# Altium project Dual Feeder Controller.PrjPCB (part 1 of 2)
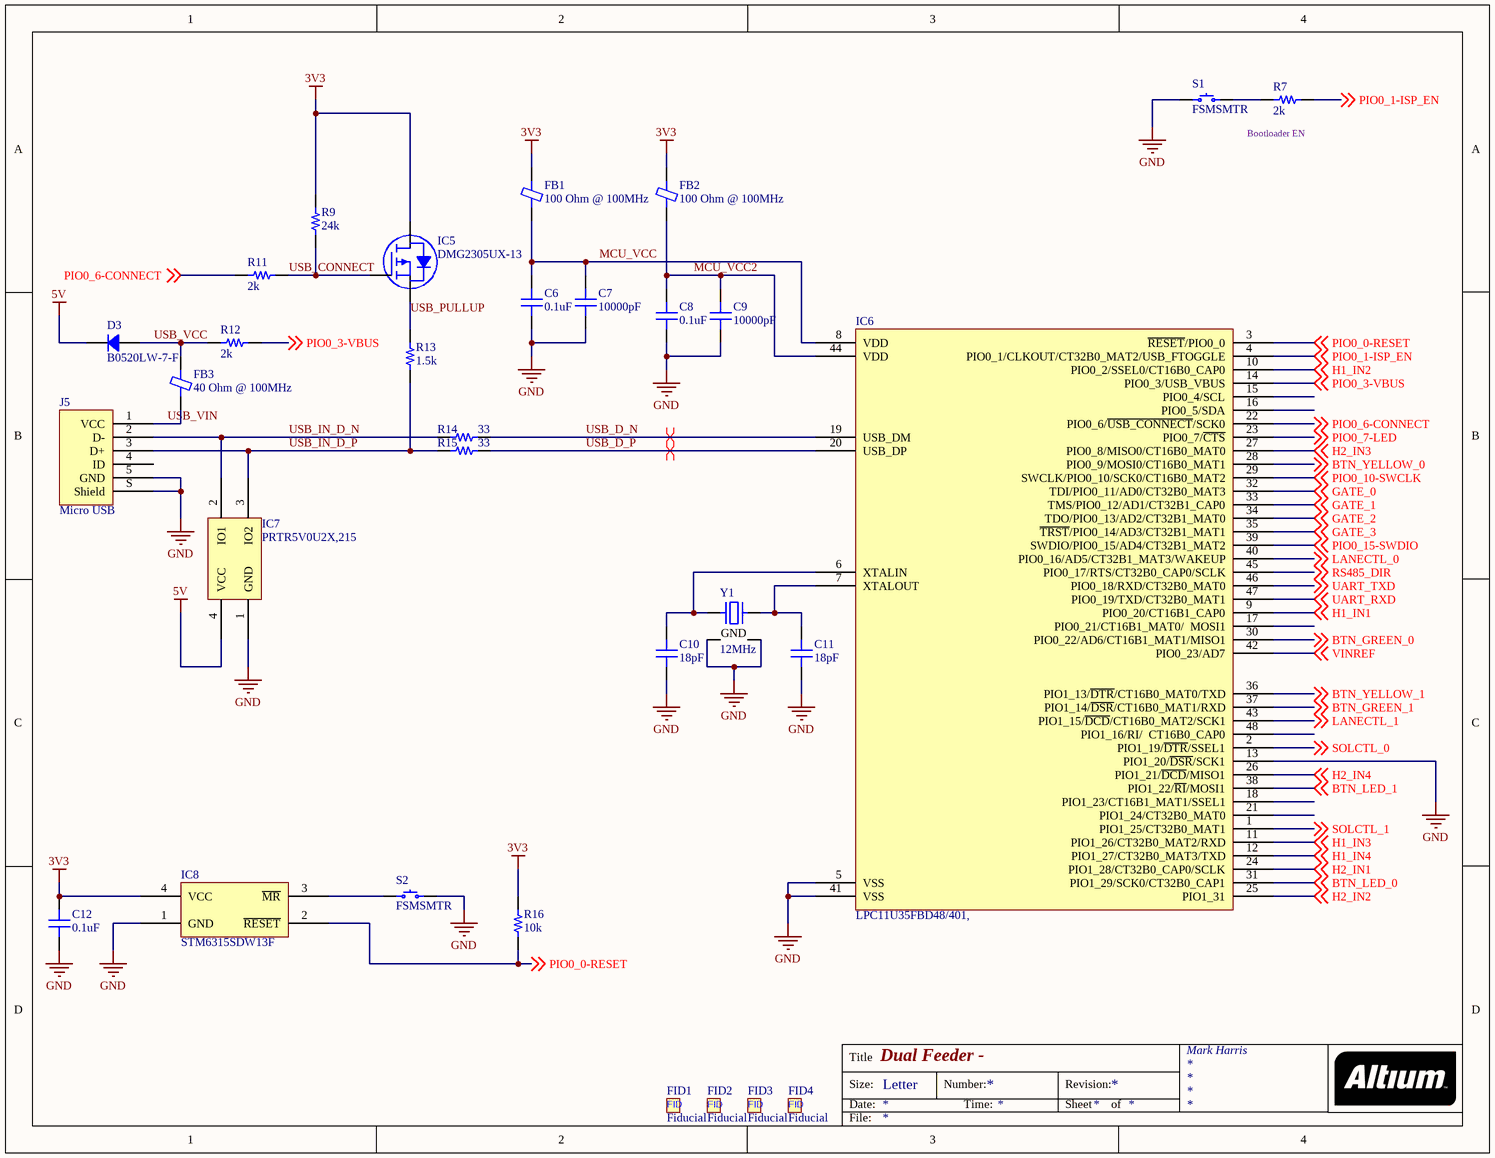
[diagram p0: Controller.SchDoc]
6 sheets, 133 parts. Net scope: global (net labels, ports and power ports of the same name join across sheets).
Board files: Feeder Board.PcbDoc, Feeder Panel.PcbDoc
Sheets:
  Controller.SchDoc
  Connectors.SchDoc
  Motor Drivers.SchDoc
  Power Supply.SchDoc
  Solenoid Drivers.SchDoc
  Light Gates.SchDoc

## Sheet Controller.SchDoc: Dual Feeder -
size Letter; DrawnBy: Mark Harris; Engineer: Mark Harris; Organization: Mark Harris; ProjectName: Dual Feeder Controller

### Parts
C6  0.1uF  [CAP 0603/1608]
C7  10000pF  [CAP 0603/1608]
C8  0.1uF  [CAP 0603/1608]
C9  10000pF  [CAP 0603/1608]
C10  18pF  [CAP 0603/1608]
C11  18pF  [CAP 0603/1608]
C12  0.1uF  [CAP 0603/1608]
D3  B0520LW-7-F  [SOD-123]
FB1  100 Ohm @ 100MHz  [FER 0603/1608]
FB2  100 Ohm @ 100MHz  [FER 0603/1608]
FB3  40 Ohm @ 100MHz  [FER 0805/2012]
FID1  Fiducial  [Fiducial]  (no BOM)
FID2  Fiducial  [Fiducial]  (no BOM)
FID3  Fiducial  [Fiducial]  (no BOM)
FID4  Fiducial  [Fiducial]  (no BOM)
IC5  DMG2305UX-13  [DIODES SOT-23-3]
IC6  LPC11U35FBD48/401,  [NXP LQFP-48 7x7mm]
IC7  PRTR5V0U2X,215  [SOT143B]
IC8  STM6315SDW13F  [ST SOT-143-4]
J5  Micro USB  [FCI USB 10118193-0001LF]
R7  2k  [RES 0603/1608]
R9  24k  [RES 0603/1608]
R11  2k  [RES 0603/1608]
R12  2k  [RES 0603/1608]
R13  1.5k  [RES 0603/1608]
R14  33  [RES 0603/1608]
R15  33  [RES 0603/1608]
R16  10k  [RES 0603/1608]
S1  FSMSMTR  [TE FSMSMTR]
S2  FSMSMTR  [TE FSMSMTR]
Y1  12MHz  [ABRACON ABM8G]

### Nets
3V3: C12.1 FB1.2 FB2.2 IC5.2(D) IC8.4(VCC) R9.2 R16.2
5V: D3.2 IC7.4(VCC)
GND: C6.2 C7.1 C8.2 C9.1 C10.1 C11.1 C12.2 IC6.5(VSS) IC6.13(PIO1_20/~{DSR}/SCK1) IC6.41(VSS) IC7.1(GND) IC8.1(GND) J5.5(GND) J5.S(Shield) S1.1 S2.2 Y1.2(GND) Y1.4(GND)
BTN_GREEN_0: IC6.30(PIO0_22/AD6/CT16B1_MAT1/MISO1) ; off-sheet BTN_GREEN_0
BTN_GREEN_1: IC6.37(PIO1_14/~{DSR}/CT16B0_MAT1/RXD) ; off-sheet BTN_GREEN_1
BTN_LED_0: IC6.31(PIO1_29/SCK0/CT32B0_CAP1) ; off-sheet BTN_LED_0
BTN_LED_1: IC6.38(PIO1_22/~{RI}/MOSI1) ; off-sheet BTN_LED_1
BTN_YELLOW_0: IC6.28(PIO0_9/MOSI0/CT16B0_MAT1) ; off-sheet BTN_YELLOW_0
BTN_YELLOW_1: IC6.36(PIO1_13/~{DTR}/CT16B0_MAT0/TXD) ; off-sheet BTN_YELLOW_1
GATE_0: IC6.32(TDI/PIO0_11/AD0/CT32B0_MAT3) ; off-sheet GATE_0
GATE_1: IC6.33(TMS/PIO0_12/AD1/CT32B1_CAP0) ; off-sheet GATE_1
GATE_2: IC6.34(TDO/PIO0_13/AD2/CT32B1_MAT0) ; off-sheet GATE_2
GATE_3: IC6.35(~{TRST}/PIO0_14/AD3/CT32B1_MAT1) ; off-sheet GATE_3
H1_IN1: IC6.9(PIO0_20/CT16B1_CAP0) ; off-sheet H1_IN1
H1_IN2: IC6.10(PIO0_2/SSEL0/CT16B0_CAP0) ; off-sheet H1_IN2
H1_IN3: IC6.11(PIO1_26/CT32B0_MAT2/RXD) ; off-sheet H1_IN3
H1_IN4: IC6.12(PIO1_27/CT32B0_MAT3/TXD) ; off-sheet H1_IN4
H2_IN1: IC6.24(PIO1_28/CT32B0_CAP0/SCLK) ; off-sheet H2_IN1
H2_IN2: IC6.25(PIO1_31) ; off-sheet H2_IN2
H2_IN3: IC6.27(PIO0_8/MISO0/CT16B0_MAT0) ; off-sheet H2_IN3
H2_IN4: IC6.26(PIO1_21/~{DCD}/MISO1) ; off-sheet H2_IN4
LANECTL_0: IC6.40(PIO0_16/AD5/CT32B1_MAT3/WAKEUP) ; off-sheet LANECTL_0
LANECTL_1: IC6.43(PIO1_15/~{DCD}/CT16B0_MAT2/SCK1) ; off-sheet LANECTL_1
MCU_VCC: C6.1 C7.2 FB1.1 IC6.8(VDD)
MCU_VCC2: C8.1 C9.2 FB2.1 IC6.44(VDD)
PIO0_0-RESET: IC6.3(~{RESET}/PIO0_0) IC8.2(~{RESET}) R16.1 ; off-sheet PIO0_0-RESET
PIO0_1-ISP_EN: IC6.4(PIO0_1/CLKOUT/CT32B0_MAT2/USB_FTOGGLE) R7.1 ; off-sheet PIO0_1-ISP_EN
PIO0_3-VBUS: IC6.14(PIO0_3/USB_VBUS) R12.1 ; off-sheet PIO0_3-VBUS
PIO0_6-CONNECT: IC6.22(PIO0_6/~{USB_CONNECT}/SCK0) R11.1 ; off-sheet PIO0_6-CONNECT
PIO0_7-LED: IC6.23(PIO0_7/~{CTS}) ; off-sheet PIO0_7-LED
PIO0_10-SWCLK: IC6.29(SWCLK/PIO0_10/SCK0/CT16B0_MAT2) ; off-sheet PIO0_10-SWCLK
PIO0_15-SWDIO: IC6.39(SWDIO/PIO0_15/AD4/CT32B1_MAT2) ; off-sheet PIO0_15-SWDIO
RS485_DIR: IC6.45(PIO0_17/RTS/CT32B0_CAP0/SCLK) ; off-sheet RS485_DIR
SOLCTL_0: IC6.2(PIO1_19/~{DTR}/SSEL1) ; off-sheet SOLCTL_0
SOLCTL_1: IC6.1(PIO1_25/CT32B0_MAT1) ; off-sheet SOLCTL_1
UART_RXD: IC6.47(PIO0_19/TXD/CT32B0_MAT1) ; off-sheet UART_RXD
UART_TXD: IC6.46(PIO0_18/RXD/CT32B0_MAT0) ; off-sheet UART_TXD
USB_CONNECT: IC5.1(G) R9.1 R11.2
USB_D_N: IC6.19(USB_DM) R14.2
USB_D_P: IC6.20(USB_DP) R15.2
USB_IN_D_N: IC7.2(IO1) J5.2(D-) R14.1
USB_IN_D_P: IC7.3(IO2) J5.3(D+) R13.1 R15.1
USB_PULLUP: IC5.3(S) R13.2
USB_VCC: D3.1 FB3.2 R12.2
USB_VIN: FB3.1 J5.1(VCC)
VINREF: IC6.42(PIO0_23/AD7) ; off-sheet VINREF
NetC10_2: C10.2 IC6.6(XTALIN) Y1.1
NetC11_2: C11.2 IC6.7(XTALOUT) Y1.3
NetIC8_3: IC8.3(~{MR}) S2.1
NetR7_2: R7.2 S1.2

Not connected (* = marked no-connect by the designer): IC6 15(PIO0_4/SCL) 16(PIO0_5/SDA) 17(PIO0_21/CT16B1_MAT0/__MOSI1) 18(PIO1_23/CT16B1_MAT1/SSEL1) 21(PIO1_24/CT32B0_MAT0) 48(PIO1_16/RI/__CT16B0_CAP0); J5 4(ID)

### Layout directives
differential pair: USB_D_N, USB_D_P

### Notes on the sheet
- Bootloader EN
- Title
- Size:
- Date:
- Letter
- Number:
- Time:
- Revision:
- Sheet
- of
- File:
- (in symbol Fiducial) FID

### Library data of the parts
C6 C8 C12 = CL10B104JB8NNNC: CAP CER 0.1UF 50V X7R 0603; Manufacturer: Samsung Electro-Mechanics America, Inc.; TemperatureRange: -55C ~ 125C; Tolerance: 5%; Value: 0.1uF; Part Number: CL10B104JB8NNNC; PartId: 5416; Supplier 1: Digi-Key; Supplier Part Number 1: 1276-1033-2-ND; ComponentLink1Description: Datasheet; ComponentLink1URL: http://www.samsungsem.com/kr/support/product-search/mlcc/CL10B104JB8NNNC.jsp; ComponentLink2Description: Digi-Key listing; ComponentLink2URL: http://digikey.com/product-detail/en/CL10B104JB8NNNC/1276-1033-2-ND/3886691; TemperatureCoefficient: X7R; Voltage: 50V; Price: 0.0132; Type: -; Device Package: 0603 (1608 Metric)
C7 C9 = CL10B103KB8NCNC: CAP CER 10000PF 50V X7R 0603; Manufacturer: Samsung Electro-Mechanics America, Inc.; TemperatureRange: -55C ~ 125C; Tolerance: 10%; Value: 10000pF; Part Number: CL10B103KB8NCNC; PartId: 13008; Supplier 1: Digi-Key; Supplier Part Number 1: 1276-1921-2-ND; ComponentLink1Description: Datasheet; ComponentLink1URL: http://www.samsungsem.com/kr/support/library/product-catalog/__icsFiles/afieldfile/2015/11/18/MLCC.pdf; ComponentLink2Description: Digi-Key Listing; ComponentLink2URL: https://www.digikey.com/product-detail/en/samsung-electro-mechanics-america-inc/CL10B103KB8NCNC/1276-1921-2-ND/3887579; TemperatureCoefficient: X7R; Voltage: 50V; Price: 0.0032; Device Package: 0603 (1608 Metric)
C10 C11 = C0603C180J5GACTU: CAP CER 18PF 50V NP0 0603; Manufacturer: Kemet; TemperatureRange: -55C ~ 125C; TemperatureCoefficient: C0G, NP0; Tolerance: 5%; Value: 18pF; Part Number: C0603C180J5GACTU; PartId: 13028; Supplier 1: Digi-Key; Supplier Part Number 1: 399-1052-2-ND; ComponentLink1Description: Datasheet; ComponentLink1URL: http://www.kemet.com/docfinder?Partnumber=C0603C180J5GACTU; ComponentLink2Description: Digi-Key Listing; ComponentLink2URL: https://www.digikey.com/product-detail/en/kemet/C0603C180J5GACTU/399-1052-2-ND/411054; Voltage: 50V; Price: 0.0064; Device Package: 0603 (1608 Metric)
D3 = B0520LW-7-F: DIODE SCHOTTKY 20V 500MA SOD123; Manufacturer: Diodes Incorporated; Current Reverse Leakage @ Vr: 250uA @ 20V; Voltage Forward (Vf): 385mV @ 500mA; Part Number: B0520LW-7-F; PartId: 14596; Supplier 1: Digi-Key; Supplier Part Number 1: B0520LW-FDITR-ND; ComponentLink1Description: Datasheet; ComponentLink1URL: http://www.diodes.com/_files/datasheets/ds30051.pdf; ComponentLink2Description: Digi-Key Listing; ComponentLink2URL: https://www.digikey.com/product-detail/en/diodes-incorporated/B0520LW-7-F/B0520LW-FDITR-ND/717687; Junction Operating Temperature: -65C ~ 125C; Price: 0.0552; Type: Schottky; Device Package: SOD-123; Voltage DC Reverse (Vr): 20V; Current Rectified: 500mA
FB1 FB2 = BKP1608HS101-T: FERRITE CHIP 100 OHM 0603; Manufacturer: Taiyo Yuden; Type: Differential Mode - Single; DC Resistance: 50 mOhm Max; Current Rating: 1.7A; Part Number: BKP1608HS101-T; PartId: 6594; Value: 100 Ohm @ 100MHz; Supplier 1: Digi-Key; Supplier Part Number 1: 587-1922-2-ND; ComponentLink1Description: Datasheet; ComponentLink1URL: http://ds.yuden.co.jp/TYCOMPAS/ut/detail.do?productNo=BKP1608HS101-T&fileName=BKP1608HS101-T_SS&mode=specSheetDownload; ComponentLink2Description: Digi-Key listing; ComponentLink2URL: http://digikey.com/product-detail/en/BKP1608HS101-T/587-1922-2-ND/957775; Price: 0.0247; Device Package: 0603 (1608 Metric)
FB3 = MMZ2012S400AT000: FERRITE CHIP 40 OHM 0805; Manufacturer: TDK Corporation; Type: Differential Mode - Single; DC Resistance: 100 mOhm Max; Current Rating: 1A; Part Number: MMZ2012S400AT000; PartId: 6800; Value: 40 Ohm @ 100MHz; Supplier 1: Digi-Key; Supplier Part Number 1: 445-2201-2-ND; ComponentLink1Description: Datasheet; ComponentLink1URL: https://product.tdk.com/info/en/catalog/datasheets/beads_commercial_signal_mmz2012_en.pdf; ComponentLink2Description: Digi-Key listing; ComponentLink2URL: http://digikey.com/product-detail/en/MMZ2012S400AT000/445-2201-2-ND/765060; Price: 0.0344; Device Package: 0805 (2012 Metric)
IC5 = DMG2305UX-13: MOSFET P-CH 20V 4.2A SOT23; Manufacturer: Diodes Incorporated; Rds On (Max) at Id, Vgs: 52 mOhm @ 4.2A, 4.5V; Vgs(th) (Max) at Id: 900mV @ 250uA; Gate Charge (Qg): 10.2nC @ 4.5V; Input Capacitance (Ciss) at Vds: 808pF @ 15V; Power - Max: 1.4W; Current Continuous Drain: 4.2A (Ta); Part Number: DMG2305UX-13; PartId: 8181; Supplier 1: Digi-Key; Supplier Part Number 1: DMG2305UX-13DITR-ND; ComponentLink1Description: Datasheet; ComponentLink1URL: http://www.diodes.com/_files/datasheets/DMG2305UX.pdf; ComponentLink2Description: Digi-Key Listing; ComponentLink2URL: http://www.digikey.com/product-detail/en/DMG2305UX-13/DMG2305UX-13DITR-ND/4251560; Price: 0.0477; Type: MOSFET P-Channel, Metal Oxide; Device Package: TO-236-3, SC-59, SOT-23-3; Drain to Source Voltage (Vdss): 20V; Features: Standard
IC6 = LPC11U35FBD48/401,: IC MCU ARM 64KB FLASH 48LQFP; Manufacturer: NXP Semiconductors; Core Processor: ARM Cortex-M0; Core Size: 32-Bit; Speed: 50MHz; Number Of IO: 40; Program Memory Size: 64KB (64K x 8); EEPROM Size: 4K x 8; Ram Size: 10K x 8; Data Converters: A/D 8x10b; Oscillator Type: Internal; Part Number: LPC11U35FBD48/401,; PartId: 9224; Supplier 1: Digi-Key; Supplier Part Number 1: 568-9584-ND; ComponentLink1Description: Datasheet; ComponentLink1URL: http://www.nxp.com/documents/data_sheet/LPC11U3X.pdf; ComponentLink2Description: Digi-Key Listing; ComponentLink2URL: https://www.digikey.com/product-detail/en/LPC11U35FBD48%2F401,/568-9584-ND/3462837; Price: 4.32; Device Package: 48-LQFP; Series: LPC11Uxx; Program Memory Type: FLASH
IC7 = PRTR5V0U2X,215: TVS DIODE 5.5VWM SOT143B; Manufacturer: NXP Semiconductors; Voltage (Breakdown): 6V; Voltage (Reverse Standoff): 5.5V (Max); Part Number: PRTR5V0U2X,215; PartId: 9755; Supplier 1: Digi-Key; Supplier Part Number 1: 568-4140-2-ND; ComponentLink1Description: Datasheet; ComponentLink1URL: http://www.nxp.com/documents/data_sheet/PRTR5V0U2X.pdf; ComponentLink2Description: Digi-Key Listing; ComponentLink2URL: http://www.digikey.com/product-detail/en/nxp-semiconductors/PRTR5V0U2X,215/568-4140-2-ND/1163690; Operating Temperature: -40C ~ 85C (TA); Price: 0.1794; Type: Steering (Rail to Rail); Device Package: TO-253-4, TO-253AA; Power - Peak Pulse: -; Current - Peak Pulse: -; Voltage (Clamping): -
IC8 = STM6315SDW13F: IC MPU RESET 2.93V 210MS SOT143-; Manufacturer: STMicroelectronics; Voltages Monitored: 1; Output: Open Drain or Open Collector; Reset: Active Low; Reset Timeout: 112 ms Minimum; PartId: 16368; Part Number: STM6315SDW13F; Supplier 1: Digi-Key; Supplier Part Number 1: 497-4975-2-ND; ComponentLink1Description: Datasheet; ComponentLink1URL: http://www.st.com/web/en/resource/technical/document/datasheet/CD00081393.pdf; ComponentLink2Description: Digi-Key Listing; ComponentLink2URL: http://www.digikey.com/product-detail/en/stmicroelectronics/STM6315SDW13F/497-4975-2-ND/1003395; Price: 0.2185; Type: Simple Reset/Power-On Reset; Device Package: TO-253-4, TO-253AA; Operating Temperature: -40C ~ 125C (TA); Voltage - Threshold: 2.93V
J5 = 10118193-0001LF: CONN USB MICRO B RECPT SMT R/A; Manufacturer: FCI; Number Of Positions: 5; Part Number: 10118193-0001LF; PartId: 7864; Supplier 1: Digi-Key; Supplier Part Number 1: 609-4616-2-ND; ComponentLink1Description: Datasheet; ComponentLink1URL: http://portal.fciconnect.com/Comergent//fci/drawing/10118193.pdf; ComponentLink2Description: Digi-Key Listing; ComponentLink2URL: http://www.digikey.ca/product-detail/en/10118193-0001LF/609-4616-2-ND/2785388; Price: 0.2823; Type: USB - micro B; Series: USB 2.0
R7 R11 R12 = ERJ-3GEYJ202V: RES SMD 2K OHM 5% 1/10W 0603; Manufacturer: Panasonic Electronic Components; TemperatureRange: -55C ~ 155C; TemperatureCoefficient: 200ppm/C; PowerRating: 0.1W, 1/10W; Value: 2k; Part Number: ERJ-3GEYJ202V; PartId: 11229; Supplier 1: Digi-Key; Supplier Part Number 1: P2.0KGTR-ND; ComponentLink1Description: Datasheet; ComponentLink1URL: http://industrial.panasonic.com/www-cgi/jvcr13pz.cgi?E+PZ+3+AOA0001+ERJ3GEYJ202V+7+WW; ComponentLink2Description: Digi-Key Listing; ComponentLink2URL: https://www.digikey.com/product-detail/en/panasonic-electronic-components/ERJ-3GEYJ202V/P2.0KGTR-ND/104349; Tolerance: 5%; Price: 0.002; Device Package: 0603 (1608 Metric)
R9 = ERJ-3GEYJ243V: RES SMD 24K OHM 5% 1/10W 0603; Manufacturer: Panasonic Electronic Components; TemperatureRange: -55C ~ 155C; TemperatureCoefficient: 200ppm/C; PowerRating: 0.1W, 1/10W; Value: 24k; Part Number: ERJ-3GEYJ243V; PartId: 11281; Supplier 1: Digi-Key; Supplier Part Number 1: P24KGTR-ND; ComponentLink1Description: Datasheet; ComponentLink1URL: http://industrial.panasonic.com/www-cgi/jvcr13pz.cgi?E+PZ+3+AOA0001+ERJ3GEYJ243V+7+WW; ComponentLink2Description: Digi-Key Listing; ComponentLink2URL: https://www.digikey.com/product-detail/en/panasonic-electronic-components/ERJ-3GEYJ243V/P24KGTR-ND/135737; Tolerance: 5%; Price: 0.002; Device Package: 0603 (1608 Metric)
R13 = ERJ-3GEYJ152V: RES SMD 1.5K OHM 5% 1/10W 0603; Manufacturer: Panasonic Electronic Components; TemperatureRange: -55C ~ 155C; TemperatureCoefficient: 200ppm/C; PowerRating: 0.1W, 1/10W; Value: 1.5k; Part Number: ERJ-3GEYJ152V; PartId: 11208; Supplier 1: Digi-Key; Supplier Part Number 1: P1.5KGTR-ND; ComponentLink1Description: Datasheet; ComponentLink1URL: http://industrial.panasonic.com/www-cgi/jvcr13pz.cgi?E+PZ+3+AOA0001+ERJ3GEYJ152V+7+WW; ComponentLink2Description: Digi-Key Listing; ComponentLink2URL: https://www.digikey.com/product-detail/en/panasonic-electronic-components/ERJ-3GEYJ152V/P1.5KGTR-ND/104381; Tolerance: 5%; Price: 0.002; Device Package: 0603 (1608 Metric)
R14 R15 = ERJ-3EKF33R0V: RES SMD 33 OHM 1% 1/10W 0603; Manufacturer: Panasonic Electronic Components; TemperatureRange: -55C ~ 155C; TemperatureCoefficient: 100ppm/C; PowerRating: 0.1W, 1/10W; Value: 33; Part Number: ERJ-3EKF33R0V; PartId: 901; Supplier 1: Digi-Key; Supplier Part Number 1: P33.0HTR-ND; ComponentLink1Description: Datasheet; ComponentLink1URL: http://industrial.panasonic.com/www-cgi/jvcr13pz.cgi?E+PZ+3+AOA0002+ERJ3EKF33R0V+7+WW; ComponentLink2Description: Digi-Key listing; ComponentLink2URL: http://digikey.com/product-detail/en/ERJ-3EKF33R0V/P33.0HTR-ND/1746383; Tolerance: 1%; Price: 0.0038; Type: Thick Film; Device Package: 0603 (1608 Metric)
R16 = ERJ-3GEYJ103V: RES SMD 10K OHM 5% 1/10W 0603; Manufacturer: Panasonic Electronic Components; TemperatureRange: -55C ~ 155C; TemperatureCoefficient: 200ppm/C; PowerRating: 0.1W, 1/10W; Value: 10k; Part Number: ERJ-3GEYJ103V; PartId: 11175; Supplier 1: Digi-Key; Supplier Part Number 1: P10KGTR-ND; ComponentLink1Description: Datasheet; ComponentLink1URL: http://industrial.panasonic.com/www-cgi/jvcr13pz.cgi?E+PZ+3+AOA0001+ERJ3GEYJ103V+7+WW; ComponentLink2Description: Digi-Key Listing; ComponentLink2URL: https://www.digikey.com/product-detail/en/panasonic-electronic-components/ERJ-3GEYJ103V/P10KGTR-ND/135662; Tolerance: 5%; Price: 0.002; Device Package: 0603 (1608 Metric)
S1 S2 = FSMSMTR: SWITCH TACTILE SPST-NO 0.05A 24V; Manufacturer: TE Connectivity Alcoswitch Switches; Switch Function: Off-Mom; Contact Rating @ Voltage: 0.05A @ 24VDC; Actuator Type: Standard; Actuator Orientation: Top Actuated; Illumination: Non-Illuminated; Operating Force: 180gf; Switch Travel: 0.25mm; Mechanical Life: 20,000 Cycles; Part Number: FSMSMTR; PartId: 8251; Supplier 1: Digi-Key; Supplier Part Number 1: 450-1758-2-ND; ComponentLink1Description: Datasheet; ComponentLink1URL: http://www.te.com/commerce/DocumentDelivery/DDEController?Action=srchrtrv&DocNm=1437566-3&DocType=Customer+Drawing&DocLang=English; ComponentLink2Description: Digi-Key Listing; ComponentLink2URL: http://www.digikey.com/product-detail/en/FSMSMTR/450-1758-2-ND/529671; Price: 0.175; Circuit: SPST-NO; Illumination Voltage: -; Illumination Type, Colour: -; Operating Temperature: -35C ~ 85C
Y1 = ABM8G-12.000MHZ-4Y-T3: CRYSTAL 12.0000MHZ 10PF SMD; Manufacturer: Abracon LLC; Frequency Stability: 30ppm; ESR: 120 Ohm; Operating Mode: Fundamental; Part Number: ABM8G-12.000MHZ-4Y-T3; PartId: 8771; Supplier 1: Digi-Key; Supplier Part Number 1: 535-10901-2-ND; ComponentLink1Description: Datasheet; ComponentLink1URL: http://www.abracon.com/Resonators/ABM8G.pdf; ComponentLink2Description: Digi-Key Listing; ComponentLink2URL: https://www.digikey.com/product-detail/en/ABM8G-12.000MHZ-4Y-T3/535-10901-2-ND/2623783; Price: 0.24; Type: MHz Crystal; Device Package: 4-SMD, No Lead (DFN, LCC); Series: ABM8G; Frequency: 12MHz; Frequency Tolerance: 30ppm; Load Capacitance: 10pF

## Sheet Connectors.SchDoc: Dual Feeder -
size Letter; DrawnBy: Mark Harris; Engineer: Mark Harris; Organization: Mark Harris; ProjectName: Dual Feeder Controller
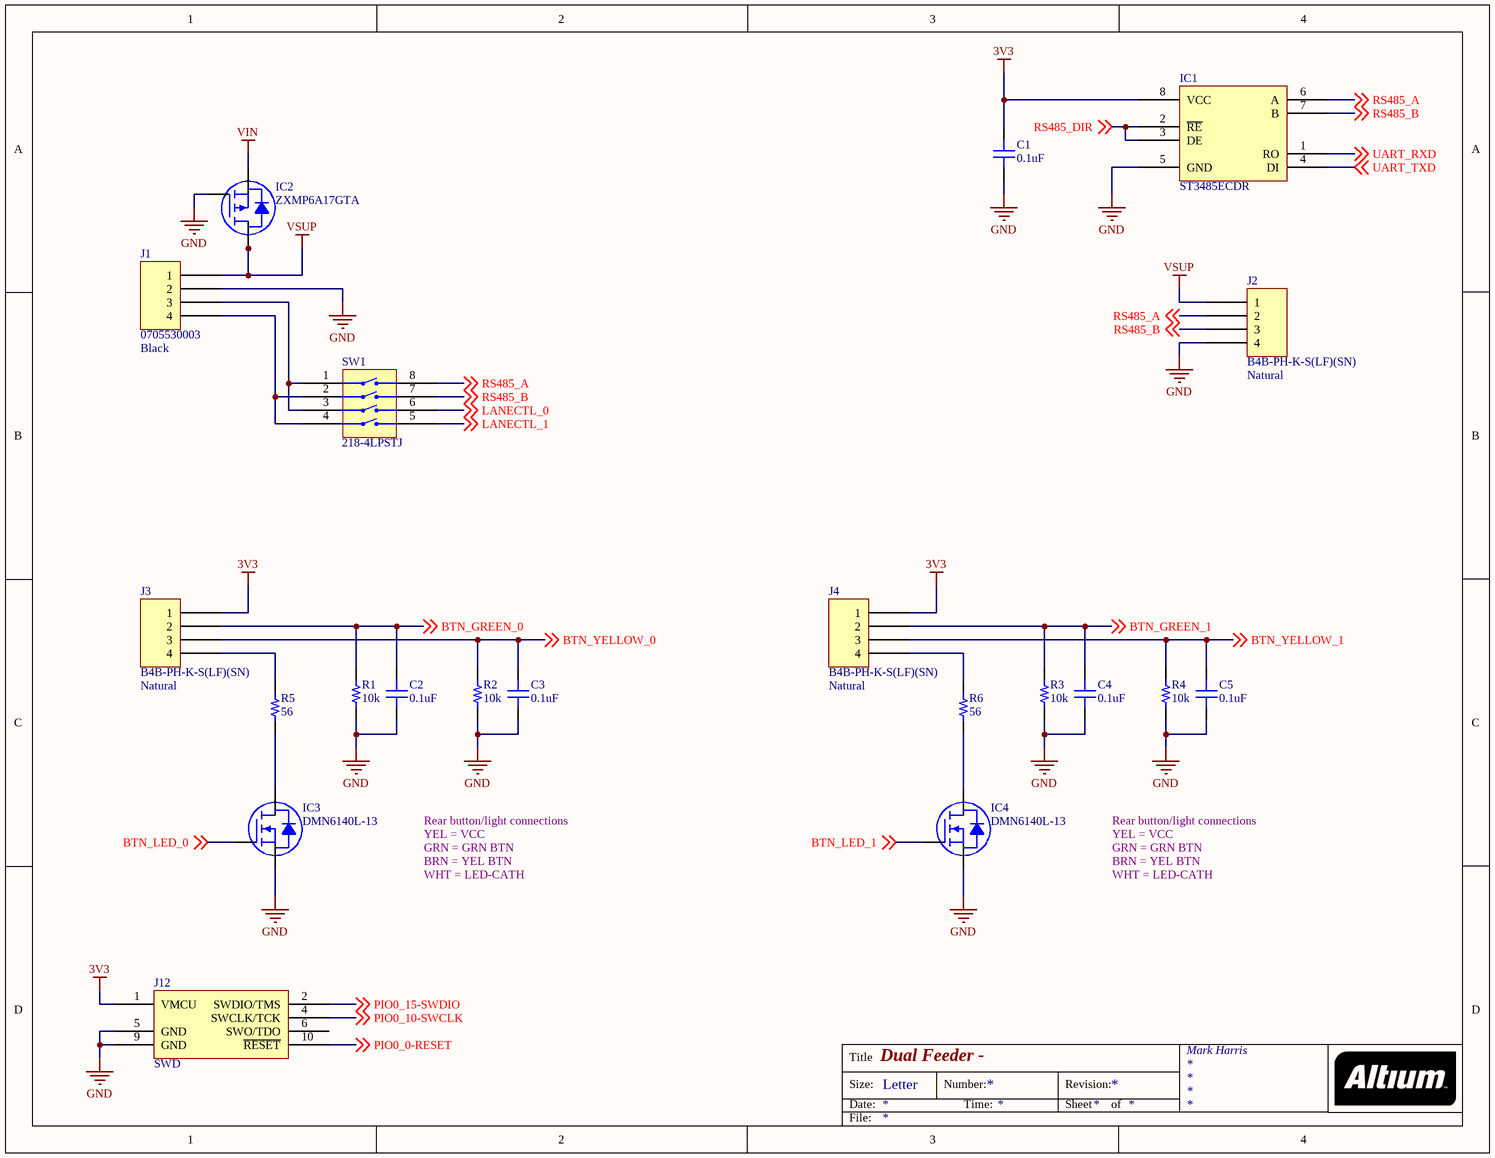
[diagram p1: Connectors.SchDoc]

### Parts
C1  0.1uF  [CAP 0603/1608]
C2  0.1uF  [CAP 0603/1608]
C3  0.1uF  [CAP 0603/1608]
C4  0.1uF  [CAP 0603/1608]
C5  0.1uF  [CAP 0603/1608]
IC1  ST3485ECDR  [ST SOIC-8N]
IC2  ZXMP6A17GTA  [DIODES SOT-223]
IC3  DMN6140L-13  [DIODES SOT-23-3]
IC4  DMN6140L-13  [DIODES SOT-23-3]
J1  0705530003  Colour: Black  [MOLEX SDA-70553-4PIN]
J2  B4B-PH-K-S(LF)(SN)  Colour: Natural  [JST B4B-PH-K]
J3  B4B-PH-K-S(LF)(SN)  Colour: Natural  [JST B4B-PH-K]
J4  B4B-PH-K-S(LF)(SN)  Colour: Natural  [JST B4B-PH-K]
J12  SWD  [10 Pin SWD]  (no BOM)
R1  10k  [RES 0603/1608]
R2  10k  [RES 0603/1608]
R3  10k  [RES 0603/1608]
R4  10k  [RES 0603/1608]
R5  56  [RES 0603/1608]
R6  56  [RES 0603/1608]
SW1  218-4LPSTJ  [CTS 218-4LPJ]

### Nets
3V3: C1.1 IC1.8(VCC) J3.1 J4.1 J12.1(VMCU)
GND: C1.2 C2.2 C3.2 C4.2 C5.2 IC1.5(GND) IC2.1(G) IC3.3(S) IC4.3(S) J1.2 J2.4 J12.5(GND) J12.9(GND) R1.1 R2.1 R3.1 R4.1
VIN: IC2.3(S)
VSUP: IC2.2(D) IC2.4(D) J1.1 J2.1
BTN_GREEN_0: C2.1 J3.2 R1.2 ; off-sheet BTN_GREEN_0
BTN_GREEN_1: C4.1 J4.2 R3.2 ; off-sheet BTN_GREEN_1
BTN_LED_0: IC3.1(G) ; off-sheet BTN_LED_0
BTN_LED_1: IC4.1(G) ; off-sheet BTN_LED_1
BTN_YELLOW_0: C3.1 J3.3 R2.2 ; off-sheet BTN_YELLOW_0
BTN_YELLOW_1: C5.1 J4.3 R4.2 ; off-sheet BTN_YELLOW_1
LANECTL_0: SW1.6 ; off-sheet LANECTL_0
LANECTL_1: SW1.5 ; off-sheet LANECTL_1
PIO0_0-RESET: J12.10(~{RESET}) ; off-sheet PIO0_0-RESET
PIO0_10-SWCLK: J12.4(SWCLK/TCK) ; off-sheet PIO0_10-SWCLK
PIO0_15-SWDIO: J12.2(SWDIO/TMS) ; off-sheet PIO0_15-SWDIO
RS485_A: IC1.6(A) J2.2 SW1.8 ; off-sheet RS485_A
RS485_B: IC1.7(B) J2.3 SW1.7 ; off-sheet RS485_B
RS485_DIR: IC1.2(~{RE}) IC1.3(DE) ; off-sheet RS485_DIR
UART_RXD: IC1.1(RO) ; off-sheet UART_RXD
UART_TXD: IC1.4(DI) ; off-sheet UART_TXD
NetIC3_2: IC3.2(D) R5.1
NetIC4_2: IC4.2(D) R6.1
NetJ1_3: J1.3 SW1.1(GND) SW1.3(GND)
NetJ1_4: J1.4 SW1.2(GND) SW1.4(GND)
NetJ3_4: J3.4 R5.2
NetJ4_4: J4.4 R6.2

Not connected (* = marked no-connect by the designer): J12 6(SWO/TDO)

### Notes on the sheet
- Rear button/light connections
- YEL = VCC
- GRN = GRN BTN
- BRN = YEL BTN
- WHT = LED-CATH
- Title
- Size:
- Date:
- Letter
- Number:
- Time:
- Revision:
- Sheet
- of
- File:

### Library data of the parts
C1-C5 = CL10B104JB8NNNC: as C6 on sheet Controller; Value: 0.1uF; Part Number: CL10B104JB8NNNC; PartId: 5416; Supplier 1: Digi-Key; Supplier Part Number 1: 1276-1033-2-ND; ComponentLink1Description: Datasheet; ComponentLink1URL: http://www.samsungsem.com/kr/support/product-search/mlcc/CL10B104JB8NNNC.jsp; ComponentLink2Description: Digi-Key listing; ComponentLink2URL: http://digikey.com/product-detail/en/CL10B104JB8NNNC/1276-1033-2-ND/3886691; TemperatureCoefficient: X7R; Voltage: 50V; Price: 0.0132; Type: -; Device Package: 0603 (1608 Metric)
IC1 = ST3485ECDR: IC TXRX RS422/485 15MBPS 8SO; Manufacturer: STMicroelectronics; Protocol: RS422, RS485; Number of Drivers/Receivers: 1/1; Duplex: Half; Receiver Hysteresis: 70mV; Voltage - Supply: 3 V ~ 3.6 V; Part Number: ST3485ECDR; PartId: 16405; Supplier 1: Digi-Key; Supplier Part Number 1: 497-6540-2-ND; ComponentLink1Description: Datasheet; ComponentLink1URL: http://www.st.com/content/ccc/resource/technical/document/datasheet/be/f4/e5/fd/b0/df/40/72/CD00003137.pdf/files/CD00003137.pdf/jcr:content/translations/en.CD00003137.pdf; ComponentLink2Description: Digi-Key Listing; ComponentLink2URL: https://www.digikey.com/product-detail/en/stmicroelectronics/ST3485ECDR/497-6540-2-ND/1039255; Price: 0.6076; Type: Transceiver; Device Package: 8-SOIC (0.154", 3.90mm Width); Operating Temperature: 0C ~ 70C; Data Rate: 15Mbps
IC2 = ZXMP6A17GTA: MOSFET P-CH 60V 3A SOT223; Manufacturer: Diodes Incorporated; Rds On (Max) at Id, Vgs: 125 mOhm @ 2.2A, 10V; Vgs(th) (Max) at Id: 1V @ 250uA; Gate Charge (Qg): 17.7nC @ 10V; Input Capacitance (Ciss) at Vds: 637pF @ 30V; Power - Max: 2W; Current Continuous Drain: 3A (Ta); Part Number: ZXMP6A17GTA; PartId: 8208; Supplier 1: Digi-Key; Supplier Part Number 1: ZXMP6A17GTR-ND; ComponentLink1Description: Datasheet; ComponentLink1URL: http://www.diodes.com/_files/datasheets/ZXMP6A17G.pdf; ComponentLink2Description: Digi-Key Listing; ComponentLink2URL: http://www.digikey.com/product-detail/en/ZXMP6A17GTA/ZXMP6A17GTR-ND/560634; Price: 0.304; Type: MOSFET P-Channel, Metal Oxide; Device Package: TO-261-4, TO-261AA; Drain to Source Voltage (Vdss): 60V; Features: Standard
IC3 IC4 = DMN6140L-13: MOSFET N-CH 60V 1.6A SOT23; Manufacturer: Diodes Incorporated; Rds On (Max) at Id, Vgs: 140 mOhm @ 1.8A, 10V; Vgs(th) (Max) at Id: 20V; Gate Charge (Qg): 8.6nC @ 10V; Input Capacitance (Ciss) at Vds: 315pF @ 40V; Current Continuous Drain: 1.6A (Ta); Part Number: DMN6140L-13; PartId: 29565; Supplier 1: Digi-Key; Supplier Part Number 1: DMN6140L-13DICT-ND; ComponentLink1Description: Datasheet; ComponentLink1URL: http://diodes.com/_files/datasheets/DMN6140L.pdf; ComponentLink2Description: Digi-Key Listing; ComponentLink2URL: https://www.digikey.com/product-detail/en/diodes-incorporated/DMN6140L-13/DMN6140L-13DICT-ND/5218250; Price: 0.51; Type: N-Channel; Device Package: TO-236-3, SC-59, SOT-23-3; Drain to Source Voltage (Vdss): 60V
J1 = 0705530003: CONN HEADER 4POS .100 R/A GOLD; Manufacturer: Molex, LLC; Pitch: 0.100" (2.54mm); Number Of Positions: 4; Part Number: 0705530003; PartId: 7806; Supplier 1: Digi-Key; Supplier Part Number 1: WM4902-ND; ComponentLink1Description: Datasheet; ComponentLink1URL: http://www.molex.com/pdm_docs/sd/705530002_sd.pdf; ComponentLink2Description: Digi-Key Listing; ComponentLink2URL: http://www.digikey.ca/product-detail/en/0705530003/WM4902-ND/114959; Price: 1.58; Type: Through Hole, Right Angle; Contact Finish: Gold; Fastening Type: Latch Holder; Number Of Rows: 1; Series: 70553
J2-J4 = B4B-PH-K-S(LF)(SN): CONN HEADER PH TOP 4POS 2MM; Manufacturer: JST Sales America Inc.; Pitch: 0.079" (2.00mm); Number Of Positions: 4; Part Number: B4B-PH-K-S(LF)(SN); PartId: 29449; Supplier 1: Digi-Key; Supplier Part Number 1: 455-1706-ND; ComponentLink1Description: Datasheet; ComponentLink1URL: http://www.jst-mfg.com/product/pdf/eng/ePH.pdf; ComponentLink2Description: Digi-Key Listing; ComponentLink2URL: http://www.digikey.com/product-detail/en/jst-sales-america-inc/B4B-PH-K-S(LF)(SN)/455-1706-ND/926613; Price: 0.24; Type: Header, Shrouded; Contact Finish: Tin; Fastening Type: Detent Lock; Number Of Rows: 1; Series: PH
R1-R4 = ERJ-3GEYJ103V: as R16 on sheet Controller; Value: 10k; Part Number: ERJ-3GEYJ103V; PartId: 11175; Supplier 1: Digi-Key; Supplier Part Number 1: P10KGTR-ND; ComponentLink1Description: Datasheet; ComponentLink1URL: http://industrial.panasonic.com/www-cgi/jvcr13pz.cgi?E+PZ+3+AOA0001+ERJ3GEYJ103V+7+WW; ComponentLink2Description: Digi-Key Listing; ComponentLink2URL: https://www.digikey.com/product-detail/en/panasonic-electronic-components/ERJ-3GEYJ103V/P10KGTR-ND/135662; Tolerance: 5%; Price: 0.002; Device Package: 0603 (1608 Metric)
R5 R6 = ERJ-3GEYJ560V: RES SMD 56 OHM 5% 1/10W 0603; Manufacturer: Panasonic Electronic Components; TemperatureRange: -55C ~ 155C; TemperatureCoefficient: 200ppm/C; PowerRating: 0.1W, 1/10W; Value: 56; Part Number: ERJ-3GEYJ560V; PartId: 11243; Supplier 1: Digi-Key; Supplier Part Number 1: P56GTR-ND; ComponentLink1Description: Datasheet; ComponentLink1URL: http://industrial.panasonic.com/www-cgi/jvcr13pz.cgi?E+PZ+3+AOA0001+ERJ3GEYJ560V+7+WW; ComponentLink2Description: Digi-Key Listing; ComponentLink2URL: https://www.digikey.com/product-detail/en/panasonic-electronic-components/ERJ-3GEYJ560V/P56GTR-ND/135638; Tolerance: 5%; Price: 0.002; Device Package: 0603 (1608 Metric)
SW1 = 218-4LPSTJ: SWITCH SLIDE DIP 4POS SPST 25MA 24V; Manufacturer: CTS Electrocomponents; Number Of Positions: 4; Voltage: 24VDC; Actuator Type: Slide (Standard); Actuator Level: Flush, Recessed; Electrical Life: 1,000 Cycles; Part Number: 218-4LPSTJ; PartId: 21129; Supplier 1: Digi-Key; Supplier Part Number 1: CT3109-ND; ComponentLink1Description: Datasheet; ComponentLink1URL: http://www.ctscorp.com/wp-content/uploads/2015/11/218.pdf; ComponentLink2Description: Digi-Key Listing; ComponentLink2URL: http://www.digikey.com/product-detail/en/cts-electrocomponents/218-4LPSTJ/CT3109-ND/5223842; Price: 1.3; TYPE: DIP Switches; Part Status: Active; Series: 218; Circuit: SPST; Current Rating: 25mA; Contact Finish: Gold; Height Above Board: 0.106" (2.70mm); Termination Style: J Lead; Body Material: -; Mechanical Life: -; Operating Temperature: -55C ~ 85C

## Sheet Motor Drivers.SchDoc: Dual Feeder - Motor Drivers
size Letter; DrawnBy: Mark Harris; Engineer: Mark Harris; Organization: Mark Harris; ProjectName: Dual Feeder Controller
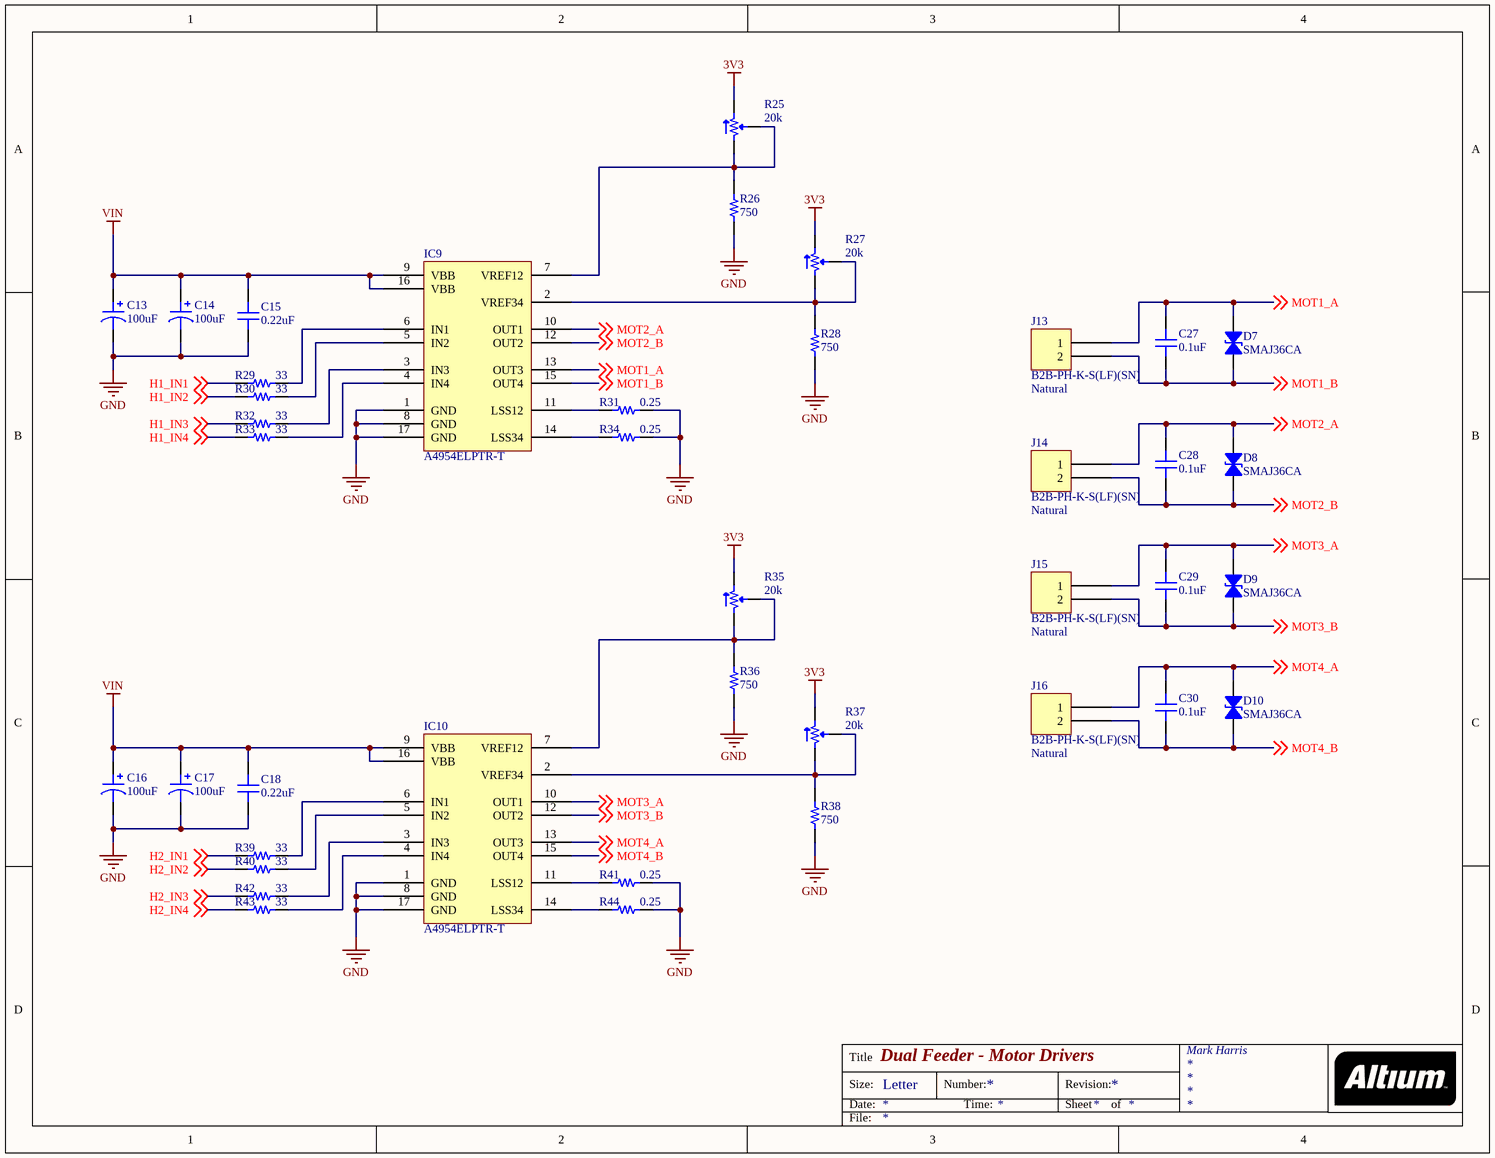
[diagram p2: Motor Drivers.SchDoc]

### Parts
C13  100uF  [CAP ALUM 8.3MM]
C14  100uF  [CAP ALUM 8.3MM]
C15  0.22uF  [CAP 0805/2012]
C16  100uF  [CAP ALUM 8.3MM]
C17  100uF  [CAP ALUM 8.3MM]
C18  0.22uF  [CAP 0805/2012]
C27  0.1uF  [CAP 0603/1608]
C28  0.1uF  [CAP 0603/1608]
C29  0.1uF  [CAP 0603/1608]
C30  0.1uF  [CAP 0603/1608]
D7  SMAJ36CA  [Bourns DO214AC SMA]
D8  SMAJ36CA  [Bourns DO214AC SMA]
D9  SMAJ36CA  [Bourns DO214AC SMA]
D10  SMAJ36CA  [Bourns DO214AC SMA]
IC9  A4954ELPTR-T  [ALLEGRO TSSOP-16EP LP]
IC10  A4954ELPTR-T  [ALLEGRO TSSOP-16EP LP]
J13  B2B-PH-K-S(LF)(SN)  Colour: Natural  [JST B2B-PH-K]
J14  B2B-PH-K-S(LF)(SN)  Colour: Natural  [JST B2B-PH-K]
J15  B2B-PH-K-S(LF)(SN)  Colour: Natural  [JST B2B-PH-K]
J16  B2B-PH-K-S(LF)(SN)  Colour: Natural  [JST B2B-PH-K]
R25  20k  [POT BOURNS TRIMPOT 3302]
R26  750  [RES 0603/1608]
R27  20k  [POT BOURNS TRIMPOT 3302]
R28  750  [RES 0603/1608]
R29  33  [RES 0603/1608]
R30  33  [RES 0603/1608]
R31  0.25  [STACKPOLE CSR1206]
R32  33  [RES 0603/1608]
R33  33  [RES 0603/1608]
R34  0.25  [STACKPOLE CSR1206]
R35  20k  [POT BOURNS TRIMPOT 3302]
R36  750  [RES 0603/1608]
R37  20k  [POT BOURNS TRIMPOT 3302]
R38  750  [RES 0603/1608]
R39  33  [RES 0603/1608]
R40  33  [RES 0603/1608]
R41  0.25  [STACKPOLE CSR1206]
R42  33  [RES 0603/1608]
R43  33  [RES 0603/1608]
R44  0.25  [STACKPOLE CSR1206]

### Nets
3V3: R25.3 R27.3 R35.3 R37.3
GND: C13.2 C14.2 C15.1 C16.2 C17.2 C18.1 IC9.1(GND) IC9.8(GND) IC9.17(GND) IC10.1(GND) IC10.8(GND) IC10.17(GND) R26.1 R28.1 R31.2 R34.2 R36.1 R38.1 R41.2 R44.2
VIN: C13.1 C14.1 C15.2 C16.1 C17.1 C18.2 IC9.9(VBB) IC9.16(VBB) IC10.9(VBB) IC10.16(VBB)
H1_IN1: R29.1 ; off-sheet H1_IN1
H1_IN2: R30.1 ; off-sheet H1_IN2
H1_IN3: R32.1 ; off-sheet H1_IN3
H1_IN4: R33.1 ; off-sheet H1_IN4
H2_IN1: R39.1 ; off-sheet H2_IN1
H2_IN2: R40.1 ; off-sheet H2_IN2
H2_IN3: R42.1 ; off-sheet H2_IN3
H2_IN4: R43.1 ; off-sheet H2_IN4
MOT1_A: C27.1 D7.2 IC9.13(OUT3) J13.1 ; off-sheet MOT1_A
MOT1_B: C27.2 D7.1 IC9.15(OUT4) J13.2 ; off-sheet MOT1_B
MOT2_A: C28.1 D8.2 IC9.10(OUT1) J14.1 ; off-sheet MOT2_A
MOT2_B: C28.2 D8.1 IC9.12(OUT2) J14.2 ; off-sheet MOT2_B
MOT3_A: C29.1 D9.2 IC10.10(OUT1) J15.1 ; off-sheet MOT3_A
MOT3_B: C29.2 D9.1 IC10.12(OUT2) J15.2 ; off-sheet MOT3_B
MOT4_A: C30.1 D10.2 IC10.13(OUT3) J16.1 ; off-sheet MOT4_A
MOT4_B: C30.2 D10.1 IC10.15(OUT4) J16.2 ; off-sheet MOT4_B
NetIC9_2: IC9.2(VREF34) R27.1 R27.2 R28.2
NetIC9_3: IC9.3(IN3) R32.2
NetIC9_4: IC9.4(IN4) R33.2
NetIC9_5: IC9.5(IN2) R30.2
NetIC9_6: IC9.6(IN1) R29.2
NetIC9_7: IC9.7(VREF12) R25.1 R25.2 R26.2
NetIC9_11: IC9.11(LSS12) R31.1
NetIC9_14: IC9.14(LSS34) R34.1
NetIC10_2: IC10.2(VREF34) R37.1 R37.2 R38.2
NetIC10_3: IC10.3(IN3) R42.2
NetIC10_4: IC10.4(IN4) R43.2
NetIC10_5: IC10.5(IN2) R40.2
NetIC10_6: IC10.6(IN1) R39.2
NetIC10_7: IC10.7(VREF12) R35.1 R35.2 R36.2
NetIC10_11: IC10.11(LSS12) R41.1
NetIC10_14: IC10.14(LSS34) R44.1

### Notes on the sheet
- Title
- Size:
- Date:
- Letter
- Number:
- Time:
- Revision:
- Sheet
- of
- File:

### Library data of the parts
C13 C14 C16 C17 = UWT1H101MNL1GS: CAP ALUM 100UF 20% 50V SMD; Manufacturer: Nichicon; TemperatureRange: -55C ~ 105C; Type: General Purpose; Ripple Current: 140mA; Lifetime @ Temp: 1000 Hrs @ 105C; Value: 100uF; Part Number: UWT1H101MNL1GS; PartId: 7285; Supplier 1: Digi-Key; Supplier Part Number 1: 493-2226-2-ND; ComponentLink1Description: Datasheet; ComponentLink1URL: http://nichicon-us.com/english/products/pdfs/e-wt.pdf; ComponentLink2Description: Digi-Key listing; ComponentLink2URL: http://digikey.com/product-detail/en/UWT1H101MNL1GS/493-2226-2-ND/589967; Tolerance: 20%; Voltage: 50V; Price: 0.2178; Device Package: Radial, Can - SMD; Impedance: -
C15 C18 = CL21B224KBFSFNE: CAP CER 0.22UF 50V X7R 0805; Manufacturer: Samsung Electro-Mechanics America, Inc.; TemperatureRange: -55C ~ 125C; Tolerance: 10%; Value: 0.22uF; Part Number: CL21B224KBFSFNE; PartId: 13765; Supplier 1: Digi-Key; Supplier Part Number 1: 1276-2948-2-ND; ComponentLink1Description: Datasheet; ComponentLink1URL: //media.digikey.com/pdf/Data%20Sheets/Samsung%20PDFs/CL21B224KBFSFNE_Spec.pdf; ComponentLink2Description: Digi-Key Listing; ComponentLink2URL: https://www.digikey.com/product-detail/en/samsung-electro-mechanics-america-inc/CL21B224KBFSFNE/1276-2948-2-ND/3888606; TemperatureCoefficient: X7R; Voltage: 50V; Price: 0.0195; Device Package: 0805 (2012 Metric)
C27-C30 = CL10B104JB8NNNC: as C6 on sheet Controller; Value: 0.1uF; Part Number: CL10B104JB8NNNC; PartId: 5416; Supplier 1: Digi-Key; Supplier Part Number 1: 1276-1033-2-ND; ComponentLink1Description: Datasheet; ComponentLink1URL: http://www.samsungsem.com/kr/support/product-search/mlcc/CL10B104JB8NNNC.jsp; ComponentLink2Description: Digi-Key listing; ComponentLink2URL: http://digikey.com/product-detail/en/CL10B104JB8NNNC/1276-1033-2-ND/3886691; TemperatureCoefficient: X7R; Voltage: 50V; Price: 0.0132; Type: -; Device Package: 0603 (1608 Metric)
D7-D10 = SMAJ36CA: TVS DIODE 36VWM 58.1VC DO214AC; Manufacturer: Bourns Inc.; Type: Zener; Bidirectional Channels: 1; Power - Peak Pulse: 400W; Current - Peak Pulse: 6.9A; Voltage (Clamping): 58.1V; Voltage (Breakdown): 40V; Voltage (Reverse Standoff): 36V; Part Number: SMAJ36CA; PartId: 14838; Supplier 1: Digi-Key; Supplier Part Number 1: SMAJ36CABTR-ND; ComponentLink1Description: Datasheet; ComponentLink1URL: http://www.bourns.com/docs/Product-Datasheets/SMAJ.pdf; ComponentLink2Description: Digi-Key Listing; ComponentLink2URL: https://www.digikey.com/product-detail/en/bourns-inc/SMAJ36CA/SMAJ36CABTR-ND/2254607; Operating Temperature: -55C ~ 150C (TJ); Price: 0.0992; Device Package: DO-214AC, SMA
IC9 IC10 = A4954ELPTR-T: IC MOTOR DRIVER PAR 16TSSOP; Manufacturer: Allegro MicroSystems, LLC; Motor Type - AC, DC: Brushed DC; Function: Driver - Fully Integrated, Control and Power Stage; Output Configuration: Half Bridge (4); Interface: Parallel; Current - Output: 2A; Voltage - Supply: 8 V ~ 40 V; Part Number: A4954ELPTR-T; PartId: 27911; Supplier 1: Digi-Key; Supplier Part Number 1: 620-1384-1-ND; ComponentLink1Description: Datasheet; ComponentLink1URL: http://www.allegromicro.com/~/media/Files/Datasheets/A4954-Datasheet.ashx; ComponentLink2Description: Digi-Key Listing; ComponentLink2URL: http://www.digikey.com/product-detail/en/allegro-microsystems-llc/A4954ELPTR-T/620-1384-1-ND/2509924; Price: 2.84; Device Package: 16-TSSOP (0.173", 4.40mm Width) Exposed Pad; Motor Type - Stepper: -; Technology: DMOS; Step Resolution: -; Voltage - Load: 8 V ~ 40 V
J13-J16 = B2B-PH-K-S(LF)(SN): CONN HEADER PH TOP 2POS 2MM; Manufacturer: JST Sales America Inc.; Pitch: 0.079" (2.00mm); Number Of Positions: 2; Part Number: B2B-PH-K-S(LF)(SN); PartId: 29447; Supplier 1: Digi-Key; Supplier Part Number 1: 455-1704-ND; ComponentLink1Description: Datasheet; ComponentLink1URL: http://www.jst-mfg.com/product/pdf/eng/ePH.pdf; ComponentLink2Description: Digi-Key Listing; ComponentLink2URL: http://www.digikey.com/product-detail/en/jst-sales-america-inc/B2B-PH-K-S(LF)(SN)/455-1704-ND/926611; Price: 0.17; Type: Header, Shrouded; Contact Finish: Tin; Fastening Type: Detent Lock; Number Of Rows: 1; Series: PH
R25 R27 R35 R37 = 3302W-3-203E: TRIMMER 20K OHM 0.15W SMD; Manufacturer: Bourns Inc.; TemperatureCoefficient: 250ppm/C; Tolerance: 25%; Number Of Turns: 1; Adjustment Type: Top Adjustment; Value: 20k; Part Number: 3302W-3-203E; PartId: 29442; Supplier 1: Digi-Key; Supplier Part Number 1: 3302W-203ECT-ND; ComponentLink1Description: Datasheet; ComponentLink1URL: http://www.bourns.com/docs/Product-Datasheets/3302.pdf; ComponentLink2Description: Digi-Key Listing; ComponentLink2URL: https://www.digikey.com/product-detail/en/bourns-inc/3302W-3-203E/3302W-203ECT-ND/612878; PowerRating: 0.15W; Price: 0.97
R26 R28 R36 R38 = ERJ-3EKF7500V: RES SMD 750 OHM 1% 1/10W 0603; Manufacturer: Panasonic Electronic Components; TemperatureRange: -55C ~ 155C; TemperatureCoefficient: 100ppm/C; PowerRating: 0.1W, 1/10W; Value: 750; Part Number: ERJ-3EKF7500V; PartId: 921; Supplier 1: Digi-Key; Supplier Part Number 1: P750HTR-ND; ComponentLink1Description: Datasheet; ComponentLink1URL: http://industrial.panasonic.com/www-cgi/jvcr13pz.cgi?E+PZ+3+AOA0002+ERJ3EKF7500V+7+WW; ComponentLink2Description: Digi-Key listing; ComponentLink2URL: http://digikey.com/product-detail/en/ERJ-3EKF7500V/P750HTR-ND/196472; Tolerance: 1%; Price: 0.0038; Type: Thick Film; Device Package: 0603 (1608 Metric)
R29 R30 R32 R33 R39 R40 R42 R43 = ERJ-3EKF33R0V: as R14 on sheet Controller; Value: 33; Part Number: ERJ-3EKF33R0V; PartId: 901; Supplier 1: Digi-Key; Supplier Part Number 1: P33.0HTR-ND; ComponentLink1Description: Datasheet; ComponentLink1URL: http://industrial.panasonic.com/www-cgi/jvcr13pz.cgi?E+PZ+3+AOA0002+ERJ3EKF33R0V+7+WW; ComponentLink2Description: Digi-Key listing; ComponentLink2URL: http://digikey.com/product-detail/en/ERJ-3EKF33R0V/P33.0HTR-ND/1746383; Tolerance: 1%; Price: 0.0038; Type: Thick Film; Device Package: 0603 (1608 Metric)
R31 R34 R41 R44 = CSR1206FKR250: RES SMD 0.25 OHM 1% 1/2W 1206; Manufacturer: Stackpole Electronics Inc.; TemperatureRange: -55C ~ 155C; TemperatureCoefficient: 100ppm/C; PowerRating: 0.5W, 1/2W; Value: 0.25; Part Number: CSR1206FKR250; PartId: 9967; Supplier 1: Digi-Key; Supplier Part Number 1: CSR1206FKR250TR-ND; ComponentLink1Description: Datasheet; ComponentLink1URL: http://www.seielect.com/catalog/SEI-CSR_CSRN.pdf; ComponentLink2Description: Digi-Key Listing; ComponentLink2URL: https://www.digikey.com/product-detail/en/stackpole-electronics-inc/CSR1206FKR250/CSR1206FKR250TR-ND/1788086; Tolerance: 1%; Price: 0.072; Device Package: 1206 (3216 Metric)

## Sheet Power Supply.SchDoc: Dual Feeder -
size Letter; DrawnBy: Mark Harris; Engineer: Mark Harris; Organization: Mark Harris; ProjectName: Dual Feeder Controller
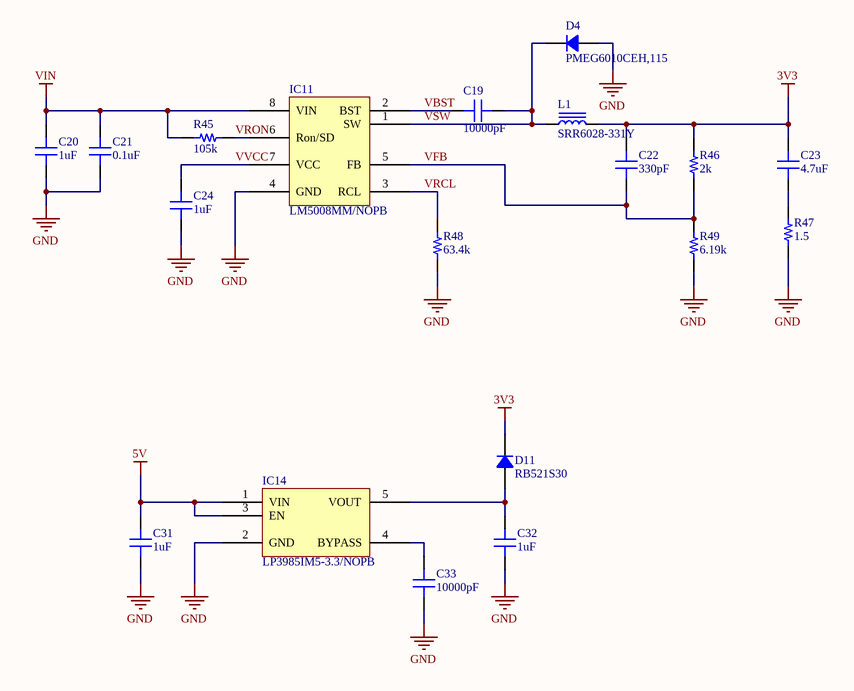
[diagram p3: Power Supply.SchDoc]

### Parts
C19  10000pF  [CAP 0603/1608]
C20  1uF  [CAP 0603/1608]
C21  0.1uF  [CAP 0603/1608]
C22  330pF  [CAP 0603/1608]
C23  4.7uF  [CAP 0603/1608]
C24  1uF  [CAP 0603/1608]
C31  1uF  [CAP 0603/1608]
C32  1uF  [CAP 0603/1608]
C33  10000pF  [CAP 0603/1608]
D4  PMEG6010CEH,115  [SOD123F]
D11  RB521S30  [SOD523F]
IC11  LM5008MM/NOPB  [TI VSSOP-8 DGK]
IC14  LP3985IM5-3.3/NOPB  [TI SOT-23-5 DBV]
L1  SRR6028-331Y  [BOURNS SRR6028]
R45  105k  [RES 0603/1608]
R46  2k  [RES 0603/1608]
R47  1.5  [RES 0603/1608]
R48  63.4k  [RES 0603/1608]
R49  6.19k  [RES 0603/1608]

### Nets
3V3: C22.2 C23.2 D11.2 L1.2 R46.1
5V: C31.2 IC14.1(VIN) IC14.3(EN)
GND: C20.1 C21.2 C24.1 C31.1 C32.1 C33.1 D4.1 IC11.4(GND) IC14.2(GND) R47.1 R48.1 R49.1
VIN: C20.2 C21.1 IC11.8(VIN) R45.1
VBST: C19.2 IC11.2(BST)
VFB: C22.1 IC11.5(FB) R46.2 R49.2
VRCL: IC11.3(RCL) R48.2
VRON: IC11.6(Ron/SD) R45.2
VSW: C19.1 D4.2 IC11.1(SW) L1.1
VVCC: C24.2 IC11.7(VCC)
NetC23_1: C23.1 R47.2
NetC32_2: C32.2 D11.1 IC14.5(VOUT)
NetC33_2: C33.2 IC14.4(BYPASS)

### Notes on the sheet
- Title
- Size:
- Date:
- Letter
- Number:
- Time:
- Revision:
- Sheet
- of
- File:

### Library data of the parts
C19 C33 = CL10B103KB8NCNC: as C7 on sheet Controller; Value: 10000pF; Part Number: CL10B103KB8NCNC; PartId: 13008; Supplier 1: Digi-Key; Supplier Part Number 1: 1276-1921-2-ND; ComponentLink1Description: Datasheet; ComponentLink1URL: http://www.samsungsem.com/kr/support/library/product-catalog/__icsFiles/afieldfile/2015/11/18/MLCC.pdf; ComponentLink2Description: Digi-Key Listing; ComponentLink2URL: https://www.digikey.com/product-detail/en/samsung-electro-mechanics-america-inc/CL10B103KB8NCNC/1276-1921-2-ND/3887579; TemperatureCoefficient: X7R; Voltage: 50V; Price: 0.0032; Device Package: 0603 (1608 Metric)
C20 C24 C31 C32 = CL10A105KB8NNNC: CAP CER 1UF 50V X5R 0603; Manufacturer: Samsung Electro-Mechanics America, Inc.; TemperatureRange: -55C ~ 85C; Tolerance: 10%; Value: 1uF; Part Number: CL10A105KB8NNNC; PartId: 13187; Supplier 1: Digi-Key; Supplier Part Number 1: 1276-1860-2-ND; ComponentLink1Description: Datasheet; ComponentLink1URL: http://www.samsungsem.com/kr/support/product-search/mlcc/CL10A105KB8NNNC.jsp; ComponentLink2Description: Digi-Key Listing; ComponentLink2URL: https://www.digikey.com/product-detail/en/samsung-electro-mechanics-america-inc/CL10A105KB8NNNC/1276-1860-2-ND/3887518; TemperatureCoefficient: X5R; Voltage: 50V; Price: 0.0236; Device Package: 0603 (1608 Metric)
C21 = CL10B104JB8NNNC: as C6 on sheet Controller; Value: 0.1uF; Part Number: CL10B104JB8NNNC; PartId: 5416; Supplier 1: Digi-Key; Supplier Part Number 1: 1276-1033-2-ND; ComponentLink1Description: Datasheet; ComponentLink1URL: http://www.samsungsem.com/kr/support/product-search/mlcc/CL10B104JB8NNNC.jsp; ComponentLink2Description: Digi-Key listing; ComponentLink2URL: http://digikey.com/product-detail/en/CL10B104JB8NNNC/1276-1033-2-ND/3886691; TemperatureCoefficient: X7R; Voltage: 50V; Price: 0.0132; Type: -; Device Package: 0603 (1608 Metric)
C22 = C0603C331J5GACTU: CAP CER 330PF 50V NP0 0603; Manufacturer: Kemet; TemperatureRange: -55C ~ 125C; TemperatureCoefficient: C0G, NP0; Tolerance: 5%; Value: 330pF; Part Number: C0603C331J5GACTU; PartId: 13118; Supplier 1: Digi-Key; Supplier Part Number 1: 399-1068-2-ND; ComponentLink1Description: Datasheet; ComponentLink1URL: http://www.kemet.com/docfinder?Partnumber=C0603C331J5GACTU; ComponentLink2Description: Digi-Key Listing; ComponentLink2URL: https://www.digikey.com/product-detail/en/kemet/C0603C331J5GACTU/399-1068-2-ND/411070; Voltage: 50V; Price: 0.0085; Device Package: 0603 (1608 Metric)
C23 = CL10A475KQ8NNNC: CAP CER 4.7UF 6.3V X5R 0603; Manufacturer: Samsung Electro-Mechanics America, Inc.; TemperatureRange: -55C ~ 85C; Tolerance: 10%; Value: 4.7uF; Part Number: CL10A475KQ8NNNC; PartId: 13295; Supplier 1: Digi-Key; Supplier Part Number 1: 1276-1045-2-ND; ComponentLink1Description: Datasheet; ComponentLink1URL: http://www.samsungsem.com/kr/support/product-search/mlcc/CL10A475KQ8NNNC.jsp; ComponentLink2Description: Digi-Key Listing; ComponentLink2URL: https://www.digikey.com/product-detail/en/samsung-electro-mechanics-america-inc/CL10A475KQ8NNNC/1276-1045-2-ND/3886703; TemperatureCoefficient: X5R; Voltage: 6.3V; Price: 0.0144; Device Package: 0603 (1608 Metric)
D4 = PMEG6010CEH,115: DIODE SCHOTTKY 60V 1A SOD123F; Manufacturer: NXP USA Inc.; Current Reverse Leakage @ Vr: 50uA @ 60V; Current Rectified: 1A (DC); Voltage Forward (Vf): 660mV @ 1A; Part Number: PMEG6010CEH,115; PartId: 29169; Supplier 1: Digi-Key; Supplier Part Number 1: 568-4104-1-ND; ComponentLink1Description: Datasheet; ComponentLink1URL: http://www.nxp.com/documents/data_sheet/PMEG6010CEH_PMEG6010CEJ.pdf; ComponentLink2Description: Digi-Key Listing; ComponentLink2URL: https://www.digikey.com/product-detail/en/nxp-usa-inc/PMEG6010CEH,115/568-4104-1-ND/1589917; Junction Operating Temperature: 150C (Max); Price: 0.38; Type: Schottky; Device Package: SOD-123F; Voltage DC Reverse (Vr): 60V
D11 = RB521S30: DIODE SCHOTTKY 30V 200MA SOD523F; Manufacturer: Fairchild Semiconductor; Type: Surface Mount; Current Reverse Leakage @ Vr: 30uA @ 10V; Voltage Forward (Vf): 500mV @ 200mA; Part Number: RB521S30; PartId: 7144; Supplier 1: Digi-Key; Supplier Part Number 1: RB521S30TR-ND; ComponentLink1Description: Datasheet; ComponentLink1URL: http://www.fairchildsemi.com/datasheets/RB/RB521S30.pdf; ComponentLink2Description: Digi-Key Listing; ComponentLink2URL: http://www.digikey.ca/product-detail/en/RB521S30/RB521S30TR-ND/1955135; Junction Operating Temperature: -55C ~ 125C; Price: 0.0455; Device Package: SC-79, SOD-523F; Reverse Recovery Time (trr): -; Voltage DC Reverse (Vr): 30V; Current Rectified: 200mA
IC11 = LM5008MM/NOPB: IC REG BUCK ADJ 0.35A 8VSSOP; Manufacturer: Texas Instruments; Function: Step-Down; Output Configuration: Positive; Output Type: Adjustable; Number Of Outputs: 1; Voltage - Input (Min): 9.5V; Voltage - Input (Max): 95V; Voltage - Output (Min/Fixed): 2.5V; Voltage - Output (Max): 75V; Current Output: 350mA; Frequency - Switching: 50kHz ~ 600kHz; Synchronous Rectifier: No; Part Number: LM5008MM/NOPB; PartId: 27912; Supplier 1: Digi-Key; Supplier Part Number 1: LM5008MM/NOPBCT-ND; ComponentLink1Description: Datasheet; ComponentLink1URL: http://www.ti.com/lit/ds/symlink/lm5008.pdf; ComponentLink2Description: Digi-Key Listing; ComponentLink2URL: https://www.digikey.com/product-detail/en/texas-instruments/LM5008MM-NOPB/LM5008MM-NOPBCT-ND/665720; Device Package: 8-TSSOP, 8-MSOP (0.118", 3.00mm Width); Price: 2.83; Series: -; Operating Temperature: -40C ~ 125C (TJ); Topology: Buck
IC14 = LP3985IM5-3.3/NOPB: IC REG LDO 3.3V 0.15A SOT23-5; Manufacturer: Texas Instruments; Topology: Positive Fixed; Voltage Dropout: 0.06V @ 150mA; Voltage - Input: Up to 6V; Current - Limit (Min): 300mA; Part Number: LP3985IM5-3.3/NOPB; PartId: 7942; Supplier 1: Digi-Key; Supplier Part Number 1: LP3985IM5-3.3/NOPBTR-ND; ComponentLink1Description: Datasheet; ComponentLink1URL: http://www.ti.com/lit/ds/symlink/lp3985.pdf; ComponentLink2Description: Digi-Key Listing; ComponentLink2URL: http://www.digikey.ca/product-detail/en/LP3985IM5-3.3%2FNOPB/LP3985IM5-3.3%2FNOPBTR-ND/440984; Price: 0.2855; Device Package: SC-74A, SOT-753; Voltage - Output: 3.3V; Operating Temperature: -40C ~ 125C
L1 = SRR6028-331Y: FIXED IND 330UH 370MA 1.4 OHM; Manufacturer: Bourns Inc.; Type: Wirewound; Material - Core: Ferrite; Tolerance: 30%; Current - Saturation: 270mA; Shielding: Shielded; DC Resistance (DCR): 1.4 Ohm Max; Q @ Freq: 11 @ 796kHz; Frequency - Self Resonant: 10MHz; Value: 330uH; Part Number: SRR6028-331Y; PartId: 27921; Supplier 1: Digi-Key; Supplier Part Number 1: SRR6028-331YCT-ND; ComponentLink1Description: Datasheet; ComponentLink1URL: http://www.bourns.com/docs/Product-Datasheets/SRR6028.pdf; ComponentLink2Description: Digi-Key Listing; ComponentLink2URL: https://www.digikey.com/product-detail/en/bourns-inc/SRR6028-331Y/SRR6028-331YCT-ND/3767853; Price: 0.68; Device Package: Nonstandard; Series: SRR6028; Inductance: 330uH; Current Rating: 370mA; Operating Temperature: -40C ~ 125C
R45 = ERJ-3EKF1053V: RES SMD 105K OHM 1% 1/10W 0603; Manufacturer: Panasonic Electronic Components; TemperatureRange: -55C ~ 155C; TemperatureCoefficient: 100ppm/C; PowerRating: 0.1W, 1/10W; Value: 105k; Part Number: ERJ-3EKF1053V; PartId: 1243; Supplier 1: Digi-Key; Supplier Part Number 1: P105KHTR-ND; ComponentLink1Description: Datasheet; ComponentLink1URL: http://industrial.panasonic.com/www-cgi/jvcr13pz.cgi?E+PZ+3+AOA0002+ERJ3EKF1053V+7+WW; ComponentLink2Description: Digi-Key listing; ComponentLink2URL: http://digikey.com/product-detail/en/ERJ-3EKF1053V/P105KHTR-ND/196079; Tolerance: 1%; Price: 0.0038; Type: Thick Film; Device Package: 0603 (1608 Metric)
R46 = ERJ-3GEYJ202V: as R7 on sheet Controller; Value: 2k; Part Number: ERJ-3GEYJ202V; PartId: 11229; Supplier 1: Digi-Key; Supplier Part Number 1: P2.0KGTR-ND; ComponentLink1Description: Datasheet; ComponentLink1URL: http://industrial.panasonic.com/www-cgi/jvcr13pz.cgi?E+PZ+3+AOA0001+ERJ3GEYJ202V+7+WW; ComponentLink2Description: Digi-Key Listing; ComponentLink2URL: https://www.digikey.com/product-detail/en/panasonic-electronic-components/ERJ-3GEYJ202V/P2.0KGTR-ND/104349; Tolerance: 5%; Price: 0.002; Device Package: 0603 (1608 Metric)
R47 = ERJ-3GEYJ1R5V: RES SMD 1.5 OHM 5% 1/10W 0603; Manufacturer: Panasonic Electronic Components; TemperatureRange: -55C ~ 155C; TemperatureCoefficient: -100/ +600ppm/C; PowerRating: 0.1W, 1/10W; Value: 1.5; Part Number: ERJ-3GEYJ1R5V; PartId: 11303; Supplier 1: Digi-Key; Supplier Part Number 1: P1.5GTR-ND; ComponentLink1Description: Datasheet; ComponentLink1URL: http://industrial.panasonic.com/www-cgi/jvcr13pz.cgi?E+PZ+3+AOA0001+ERJ3GEYJ1R5V+7+WW; ComponentLink2Description: Digi-Key Listing; ComponentLink2URL: https://www.digikey.com/product-detail/en/panasonic-electronic-components/ERJ-3GEYJ1R5V/P1.5GTR-ND/282115; Tolerance: 5%; Price: 0.002; Device Package: 0603 (1608 Metric)
R48 = ERJ-3EKF6342V: RES SMD 63.4K OHM 1% 1/10W 0603; Manufacturer: Panasonic Electronic Components; TemperatureRange: -55C ~ 155C; TemperatureCoefficient: 100ppm/C; PowerRating: 0.1W, 1/10W; Value: 63.4k; Part Number: ERJ-3EKF6342V; PartId: 1233; Supplier 1: Digi-Key; Supplier Part Number 1: P63.4KHTR-ND; ComponentLink1Description: Datasheet; ComponentLink1URL: http://industrial.panasonic.com/www-cgi/jvcr13pz.cgi?E+PZ+3+AOA0002+ERJ3EKF6342V+7+WW; ComponentLink2Description: Digi-Key listing; ComponentLink2URL: http://digikey.com/product-detail/en/ERJ-3EKF6342V/P63.4KHTR-ND/196435; Tolerance: 1%; Price: 0.0038; Type: Thick Film; Device Package: 0603 (1608 Metric)
R49 = ERJ-3EKF6191V: RES SMD 6.19K OHM 1% 1/10W 0603; Manufacturer: Panasonic Electronic Components; TemperatureRange: -55C ~ 155C; TemperatureCoefficient: 100ppm/C; PowerRating: 0.1W, 1/10W; Value: 6.19k; Part Number: ERJ-3EKF6191V; PartId: 1083; Supplier 1: Digi-Key; Supplier Part Number 1: P6.19KHTR-ND; ComponentLink1Description: Datasheet; ComponentLink1URL: http://industrial.panasonic.com/www-cgi/jvcr13pz.cgi?E+PZ+3+AOA0002+ERJ3EKF6191V+7+WW; ComponentLink2Description: Digi-Key listing; ComponentLink2URL: http://digikey.com/product-detail/en/ERJ-3EKF6191V/P6.19KHTR-ND/196419; Tolerance: 1%; Price: 0.0038; Type: Thick Film; Device Package: 0603 (1608 Metric)